# EAGLE design breakoutboard (EAGLE 9.6.2)
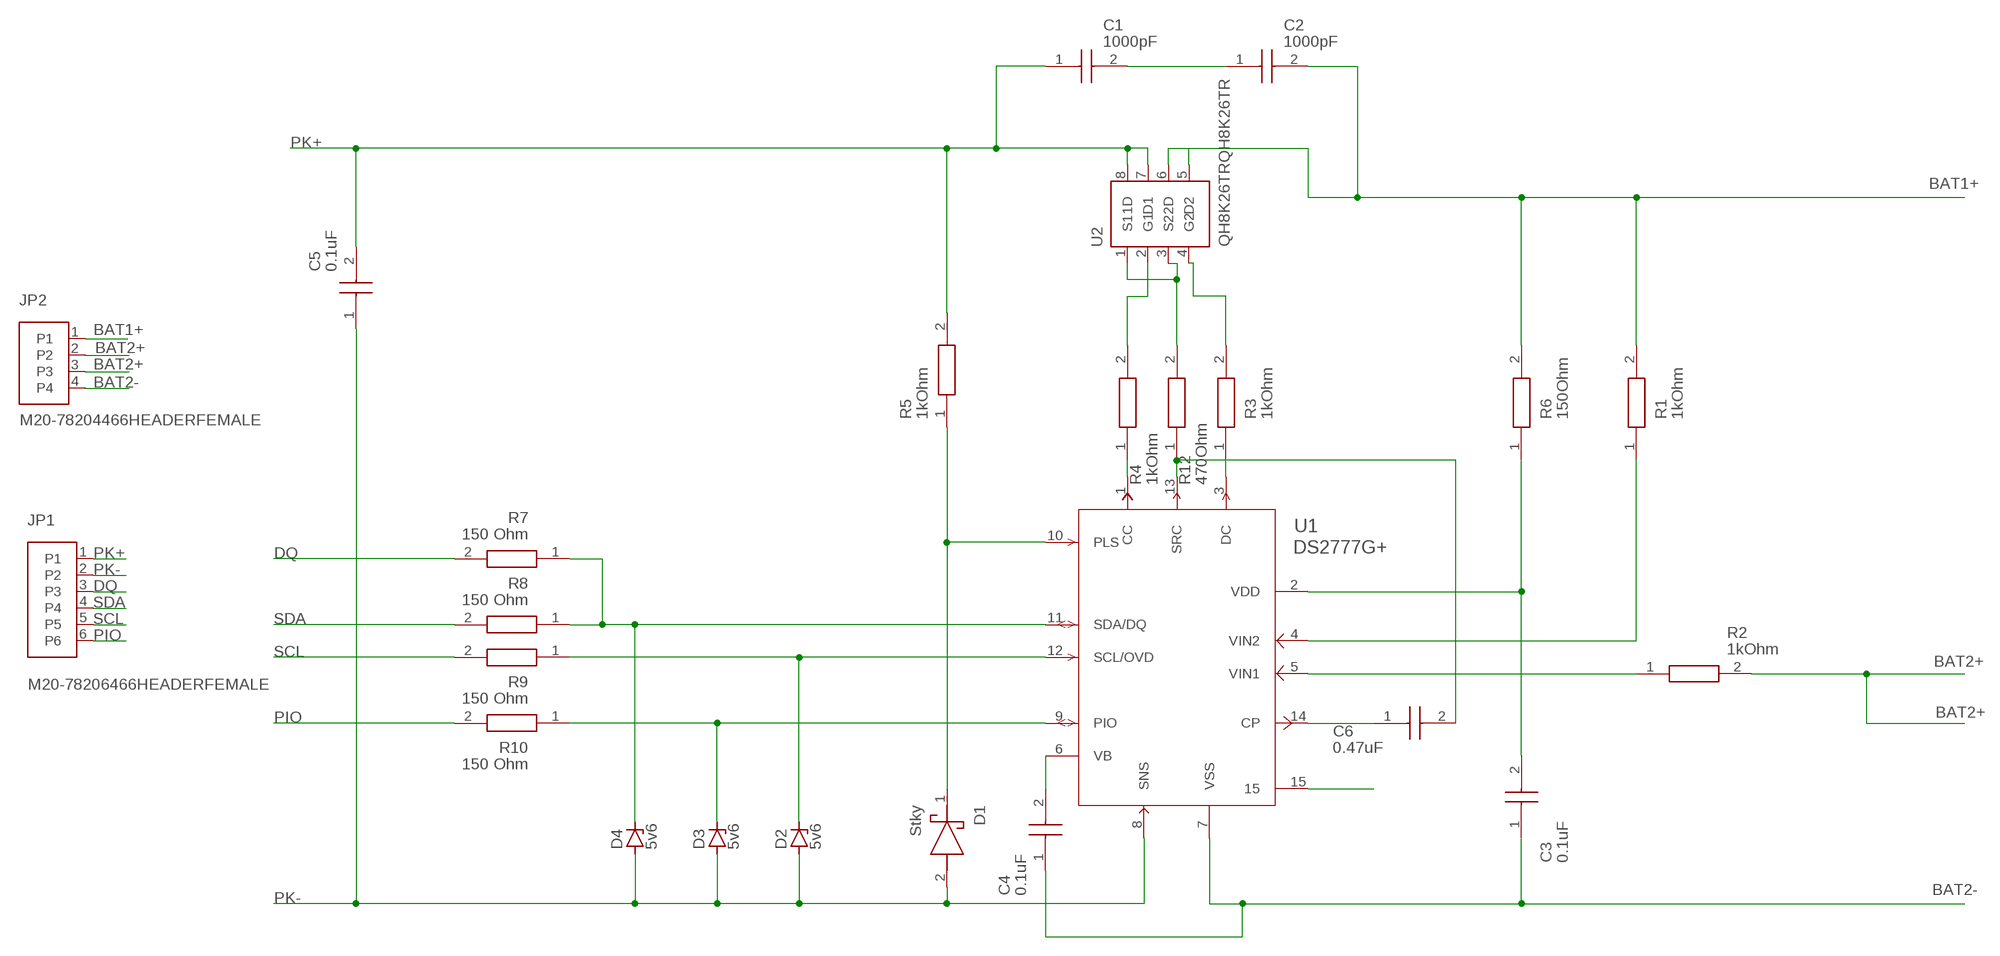
[diagram p0: schematic, sheet 1]

## Parts
C1  1000pF  C0805C102J5G72101000PF  [CAPC2012X100N]
C2  1000pF  C0805C102J5G72101000PF  [CAPC2012X100N]
C3  0.1uF  C0805C104K5RAC74110.1UF  [CAPC2012X100N]
C4  0.1uF  C0805C104K5RAC74110.1UF  [CAPC2012X100N]
C5  0.1uF  C0805C104K5RAC74110.1UF  [CAPC2012X100N]
C6  0.47uF  C0805X474K5RACLR0.47UF  [CAPC2012X100N]
D1  Stky  BAT54W-HG3-18SCHOTTKY  [SOD3715X135N]
D2  5v6  BZX584C5V6-G3-08BZX584C5V6-G3-08  [SODFL1608X75N]
D3  5v6  BZX584C5V6-G3-08BZX584C5V6-G3-08  [SODFL1608X75N]
D4  5v6  BZX584C5V6-G3-08BZX584C5V6-G3-08  [SODFL1608X75N]
JP1  M20-78206466HEADERFEMALE  [HDRVR6W65P254_1X6_1564X250X865B]
JP2  M20-78204466HEADERFEMALE  [HDRVR4W65P254_1X4_1056X250X865B]
R1  1kOhm  ERJ-P06D1500V150OHM  [RESC2012X70N]
R2  1kOhm  ERJ-P06D1500V150OHM  [RESC2012X70N]
R3  1kOhm  ERJ-P06D1500V150OHM  [RESC2012X70N]
R4  1kOhm  ERJ-P06D1500V150OHM  [RESC2012X70N]
R5  1kOhm  ERJ-P06D1500V150OHM  [RESC2012X70N]
R6  150Ohm  ERJ-P06F1001V  [RESC2012X70N]
R7  150 Ohm  ERJ-P06F1001V  [RESC2012X70N]
R8  150 Ohm  ERJ-P06F1001V  [RESC2012X70N]
R9  150 Ohm  ERJ-P06F1001V  [RESC2012X70N]
R10  150 Ohm  ERJ-P06F1001V  [RESC2012X70N]
R12  470Ohm  ERJ-UP6F4700V  [RESC2012X70N]
U1  DS2777G+  [DS2777_TDFN-15-OWN]
U2  QH8K26TRQH8K26TR  [SOTFL65P280X85-8N]

## Nets
BAT1+: C2.2 JP2.1 R1.2 R6.2 U2.5(D2) U2.6(2D)
BAT2+: JP2.2 JP2.3 R2.2
BAT2-: C3.1 C4.1 JP2.4 U1.7(VSS) U1.15
DQ: JP1.3 R7.2
N$1: R2.1 U1.5(VIN1)
N$2: R1.1 U1.4(VIN2)
N$3: C3.2 R6.1 U1.2(VDD)
N$7: R4.1 U1.1(CC)
N$8: C6.2 R12.1 U1.13(SRC)
N$9: R3.1 U1.3(DC)
N$10: R4.2 U2.2(G1)
N$11: R3.2 U2.4(G2)
N$12: R12.2 U2.1(S1) U2.3(S2)
N$13: C4.2 U1.6(VB)
N$15: C1.2 C2.1
N$16: D4.1(K) R7.1 R8.1 U1.11(SDA/DQ)
N$17: C6.1 U1.14(CP)
N$18: D1.1(K) R5.1 U1.10(PLS)
N$19: D2.1(K) R9.1 U1.12(SCL/OVD)
N$20: D3.1(K) R10.1 U1.9(PIO)
PIO: JP1.6 R10.2
PK+: C1.1 C5.2 JP1.1 R5.2 U2.7(D1) U2.8(1D)
PK-: C5.1 D1.2(A) D2.2(A) D3.2(A) D4.2(A) JP1.2 U1.8(SNS)
SCL: JP1.5 R9.2
SDA: JP1.4 R8.2

## Library data of the parts
C1 C2 = SamacSys_Parts:C0805C102J5G7210: Keramik Kondensator 1000pF
C3-C5 = SamacSys_Parts:C0805C104K5RAC7411: Cap Ceramic 0.1uF 50V X7R 10% Pad SMD 0805 125C T/R Source: Datasheet
C6 = SamacSys_Parts:C0805X474K5RACLR: Kondensator aus mehreren Keramikschichten MLCC - SMD/SMT 50V 0.47uF X7R 0805 10% Flex
D1 = SamacSys_Parts:BAT54W-HG3-18: Schottky Diodes & Rectifiers 30V Zener SKY DIODE SOD-123 Source: Datasheet <https://componentsearchengine.com/Datasheets/1/BAT54W-HG3-18.pdf>
D2-D4 = SamacSys_Parts:BZX584C5V6-G3-08: Zener-Dioden 300mW SOD-523 5.6V Small Signal
JP1 = SamacSys_Parts:M20-7820646
JP2 = SamacSys_Parts:M20-7820446
R1-R5 = SamacSys_Parts:ERJ-P06D1500V: Thick Film Resistors - SMD 0805 150ohms 0.5W 0.5% AEC-Q200 Source: Datasheet <https://componentsearchengine.com/Datasheets/1/ERJ-P06D1500V.pdf>; R: 150 Ohm
R6-R10 = SamacSys_Parts:ERJ-P06F1001V: Dickfilmwiderstände - SMD 0805 1Kohms 0.5W 1% AEC-Q200
R12 = SamacSys_Parts:ERJ-UP6F4700V: Dickfilmwiderstände - SMD 0805 0.5W 1% 470ohm Anti-sulfur AEC-Q200
U1 = SamacSys_Parts:DS2777G+
U2 = SamacSys_Parts:QH8K26TR

## Board
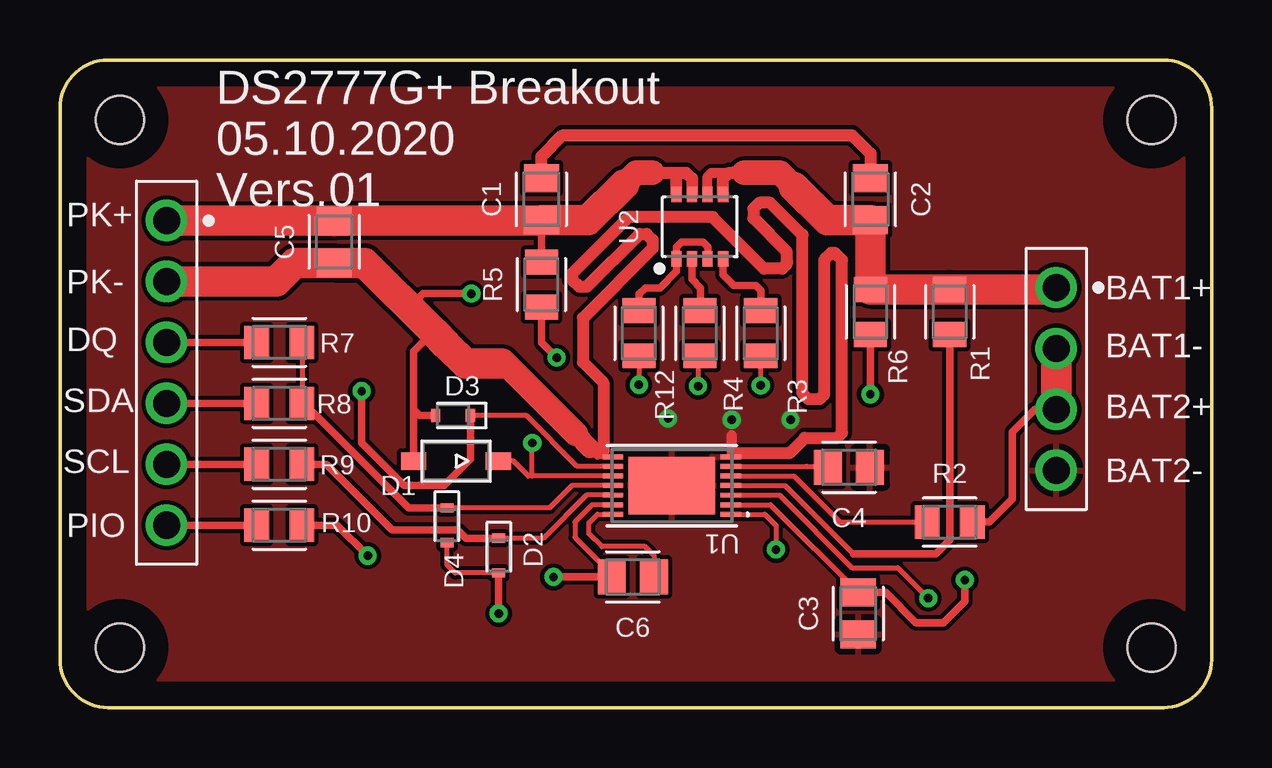
[diagram p1: board, top side]
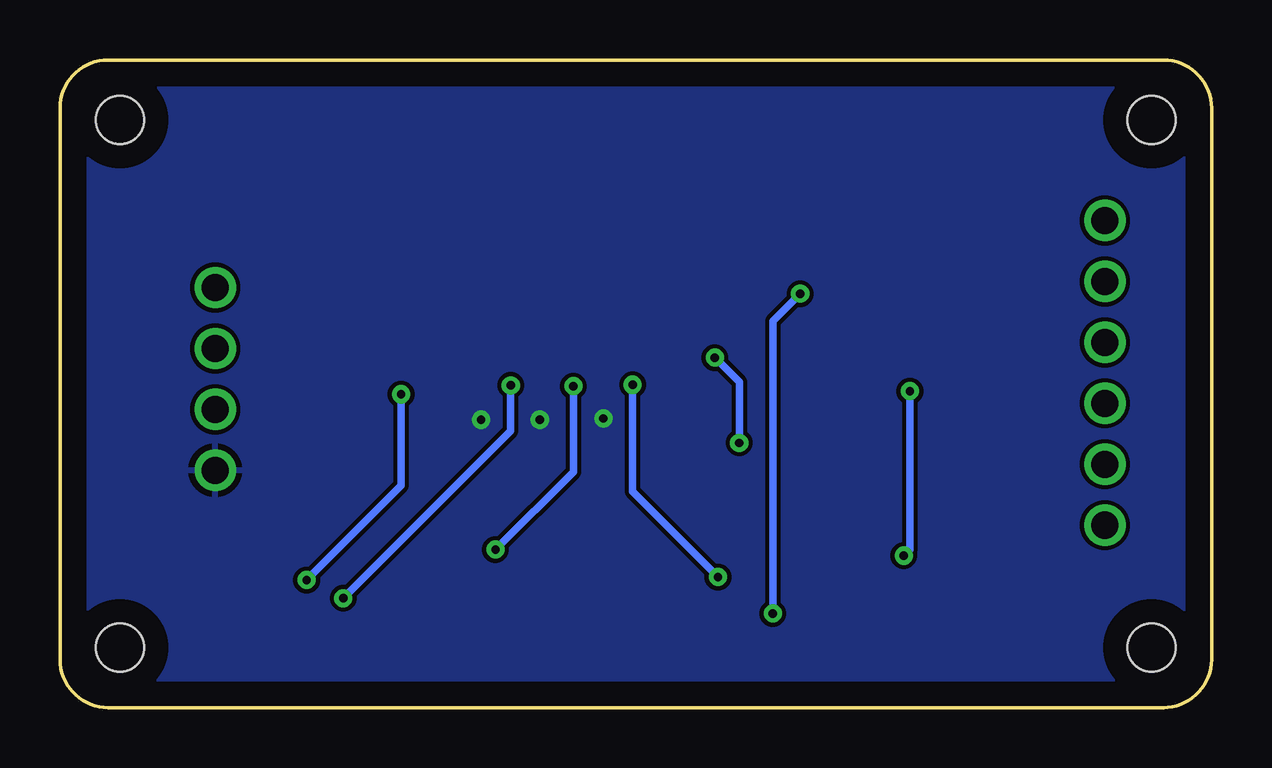
[diagram p2: board, bottom side, seen from below]

Size 48 x 27 mm. Coordinates in mm from the lower left corner, seen from the top.
Outline: 2,0 46,0 arc90 48,2 48,25 arc90 46,27 2,27 arc90 0,25 0,2 arc90 2,0
Copper layers (1*16): Top 0.07mm / dielectric 1.5mm / Bottom 0.035mm
Design rules "default *": minimum track width 6mil, minimum drill 0.35mm, track to track 0.175mm, track to pad 6mil, pad to pad 6mil, via to via 6mil, smd to smd 6mil, copper to edge 40mil, drill to drill 6mil, minimum pad ring 10mil, minimum via ring 8mil, stop-mask expansion 4mil, vias tented up to drill 0mil, thermal gap 10mil
Holes 2 mm at 2.5,2.5 45.5,2.5 2.5,24.5 45.5,24.5

### Footprints (pad centres in the part's own frame; a part is rotated, then mirrored left to right if it is on the bottom)
CAPC2012X100N = smd 1.165 x 1.465: 1 -0.875,0; 2 0.875,0
SOD3715X135N = smd 1.046 x 0.739: 1 -1.762,0; 2 1.762,0
SODFL1608X75N = smd 0.384 x 0.538: 1 -0.725,0; 2 0.725,0
HDRVR6W65P254_1X6_1564X250X865B = drill 1.126 pad 1.726: 1 0,0; 2 2.54,0; 3 5.08,0; 4 7.62,0; 5 10.16,0; 6 12.7,0
HDRVR4W65P254_1X4_1056X250X865B = drill 1.126 pad 1.726: 1 0,0; 2 2.54,0; 3 5.08,0; 4 7.62,0
RESC2012X70N = smd 1.035 x 1.379: 1 -0.94,0; 2 0.94,0
DS2777_TDFN-15-OWN = smd 0.85 x 0.204: 1 -2.55,1.2; 2 -2.55,0.8; 3 -2.55,0.4; 4 -2.55,0; 5 -2.55,-0.4; 6 -2.55,-0.8; 7 -2.55,-1.2; 8 2.35,-1.2; 9 2.35,-0.8; 10 2.35,-0.4; 11 2.35,0; 12 2.35,0.4; 13 2.35,0.8; 14 2.35,1.2 | smd 3.607 x 2.388: 15 -0.1,0
SOTFL65P280X85-8N = smd 0.65 x 0.42: 1 -1.34,0.975; 2 -1.34,0.325; 3 -1.34,-0.325; 4 -1.34,-0.975; 5 1.34,-0.975; 6 1.34,-0.325; 7 1.34,0.325; 8 1.34,0.975

### Placement (x,y rotation side)
C1  20.07,21.19 90 top
C2  33.78,21.19 270 top
C3  33.27,3.92 90 top
C4  32.89,10.02 180 top
C5  11.43,19.41 90 top
C6  23.88,5.45 180 top
D1  16.51,10.27 180 top
D2  18.29,6.33 270 top
D3  16.38,12.18 180 top
D4  16.13,7.6 270 top
JP1  4.45,20.3 270 top
JP2  41.53,17.51 270 top
R1  37.08,16.49 90 top
R2  37.08,7.73 0 top
R3  29.21,15.61 90 top
R4  26.67,15.61 90 top
R5  20.07,17.64 90 top
R6  33.78,16.49 90 top
R7  9.14,15.22 180 top
R8  9.14,12.68 180 top
R9  9.14,10.14 180 top
R10  9.14,7.6 180 top
R12  24.13,15.61 90 top
U1  25.4,9.26 180 top
U2  26.67,20.05 90 top

### Tracks (layer width: path | path; a pad name or v marks a point on that pad's centre or on a via)
BAT1+
  Top 0.406: 28,22.3 27.9,22.3 27.15,22.3 27,22.14 U2.6
  Top 0.508: U2.5 27.64,22.05 27.9,22.3 | 28.5,22.3 28,22.3
  Top 1.016: 41.45,17.43 JP2.1 | 30.6,21.7 30,22.3 28.5,22.3
  Top 1.27: 41.45,17.43 R1.2 R6.2 C2.2 31.98,20.32 30.6,21.7
BAT2+
  Top 0.2: 40.63,12.43 JP2.3
  Top 0.305: R2.2 38.73,7.73 39.7,8.7 39.7,11.5 40.63,12.43
  Top 1.27: JP2.2 JP2.3
BAT2-  (via drill 0.35)
  Top 0.152: U1.7 27.95,10.55 28,10.6
  Top 0.406: 28,10.6 28,11.35
  other vias: 25.35,12.05 30.45,12 28,12
  pour Top: 0,27 0,0 48,0 48,27
  pour Bottom: 0,27 0,0 48,0 48,27
DQ
  Top 0.305: R7.2 JP1.3
N$1
  Top 0.2: U1.5 30.58,9.65 32.51,7.73 R2.1
N$2
  Top 0.2: U1.4 30.23,9.26 33.08,6.4
  Top 0.305: R1.1 37.08,6.98 36.5,6.4 33.08,6.4
N$3  (via drill 0.35)
  Top 0.2: U1.2 29.61,8.46 C3.2
  Top 0.305: C3.2 34.43,4.8 35.69,3.54 36.83,3.54 37.72,4.43 v37.72,5.32 | v33.78,13.06 R6.1
  Bottom 0.305: v37.72,5.32 33.78,9.26 v33.78,13.06
N$7  (via drill 0.35)
  Top 0.2: v29.84,6.59 29.84,7.59 29.39,8.05 U1.1 | R4.1 26.6,14.6 v26.6,13.4
  Bottom 0.305: v29.84,6.59 26.6,9.83 v26.6,13.4
N$8  (via drill 0.35)
  Top 0.2: U1.13 22.19,8.46 21.46,7.73 21.46,7.1 23,5.56 C6.2 | R12.1 v24.13,13.46
  Top 0.305: v20.57,5.45 C6.2
  Bottom 0.305: v24.13,13.46 24.13,9 v20.57,5.45
N$9  (via drill 0.35)
  Top 0.2: U1.3 29.99,8.86 33.02,5.83 34.92,5.83 v36.2,4.56 | v29.21,13.43 R3.1
  Bottom 0.305: v36.2,4.56 29.21,11.54 v29.21,13.43
N$10
  Top 0.2: 26.7,16.57 R4.2
  Top 0.305: U2.2 26.34,17.86 26.7,17.5 26.7,16.57
N$11
  Top 0.305: U2.4 27.64,18.05 28.1,17.6 29,17.6 29.21,17.39 R3.2
N$12
  Top 0.2: U2.3
  Top 0.305: R12.2 24.13,17.23 24.4,17.5 25,17.5 25.7,18.2 U2.1 25.7,19.2 25.9,19.4 26.8,19.4 27,19.2 U2.3
N$13
  Top 0.2: U1.6 31.11,10.05 | 31.11,10.05 31.98,10.05 C4.2 | 31.11,10.05
N$15
  Top 0.508: C1.2 20.07,22.97 20.95,23.86 33.02,23.86 33.78,23.1 C2.1
N$16
  Top 0.2: U1.11 21.34,9.26 20.41,8.33 D4.1 | R7.1 R8.1
  Top 0.305: D4.1 14.54,8.33 10.18,12.68 R8.1
N$17
  Top 0.2: C6.1 24.75,6.35 24.38,6.71 22.59,6.71 22.05,7.25 22.05,7.7 22.41,8.05 U1.14
N$18  (via drill 0.35)
  Top 0.2: U1.10 19.68,9.65 | 19.68,9.65 19.52,9.65 18.91,10.27 D1.1 | 19.68,9.65 v19.68,11.03
  Top 0.305: v20.7,14.59 20.07,15.22 R5.1
  Bottom 0.305: v19.68,11.03 19.68,13.57 v20.7,14.59
N$19
  Top 0.2: U1.12 21.95,8.86 20.16,7.06 D2.1
  Top 0.305: D2.1 16.93,7.06 16.57,7.41 13.84,7.41 11.11,10.14 R9.1
N$20  (via drill 0.35)
  Top 0.2: U1.9 21.56,10.05 19.44,12.18 D3.1
  Top 0.305: R10.1 11.56,7.6 v12.83,6.33 | D3.1 17.11,10.36 16,9.26 14.35,9.26 12.57,11.03 v12.57,13.19
  Bottom 0.2: 12.57,6.59 v12.83,6.33
  Bottom 0.305: v12.57,13.19 12.57,6.59
PIO
  Top 0.305: R10.2 JP1.6
PK+
  Top 0.305: C1.1 R5.2
  Top 0.508: U2.8 25.7,22.11 25.5,22.3 | 24.7,22.3 25.5,22.3 | 25.5,22.3 26.1,22.3 26.34,22.05 U2.7
  Top 1.016: 11.42,20.3 C5.2 | 20,20.3 C1.1 | 23.5,21.8 24,22.3 24.7,22.3
  Top 1.27: JP1.1 11.42,20.3 | 20,20.3 C5.2 | C1.1 22.02,20.32 23.5,21.8
PK-  (via drill 0.35)
  Top 0.2: D1.2 14.73,10.29 | D2.2 16.47,5.61 16.13,5.95 D4.2 | U1.8 22.45,10.46 22.4,10.5
  Top 0.305: D3.2 14.99,12.18 14.73,12.43 | 14.73,12.43 14.73,10.29 | v17.14,17.26 15.14,17.26 14.56,16.68 | D2.2 v18.29,3.92 | 22.4,10.5 22.1,10.8 | 14.73,12.43 14.73,14.84 15.56,15.68
  Top 0.508: 18.41,14.34 18.57,14.34
  Top 0.813: 22.1,10.8 21.5,11.4
  Top 1.016: 21.5,11.4 18.57,14.34
  Top 1.27: 18.41,14.34 16.91,14.34 16.12,15.12 15.56,15.68 14.56,16.68 13.62,17.62 12.7,18.54 C5.1 9.79,18.54 9.01,17.76 JP1.2
  Bottom 0.305: v18.29,3.92 18.29,16.11 v17.14,17.26
SCL
  Top 0.305: R9.2 JP1.5
SDA
  Top 0.305: R8.2 JP1.4
SHUNT
  Top 0.508: 28.05,10.6 30.4,10.6 31.05,11.25 32.4,11.25 32.6,11.45 32.6,18.65 32.3,18.95 32.15,18.95 31.85,18.65 31.85,13.05 31.65,12.85 31.2,12.85 30.95,13.1 30.95,19.7 29.6,21.05 29.15,21.05 28.9,20.8 28.9,20.4 30.3,19 30.3,18.65 30.3,18.5 30.1,18.3 29.35,18.3 27.2,20.45 23.7,20.45 21.35,18.1 21.35,17.85 21.65,17.55 21.95,17.55 24.15,19.75 24.45,19.75 24.7,19.5 24.7,19.15 21.8,16.25 21.8,14.4 22.65,13.55 22.65,10.65

### Text on the board
tPlace: DS2777G+ Breakout / 05.10.2020 / Vers.01 | PK+ | PK- | BAT1+ | DQ | BAT1- | SDA | BAT2+ | SCL | BAT2- | PIO